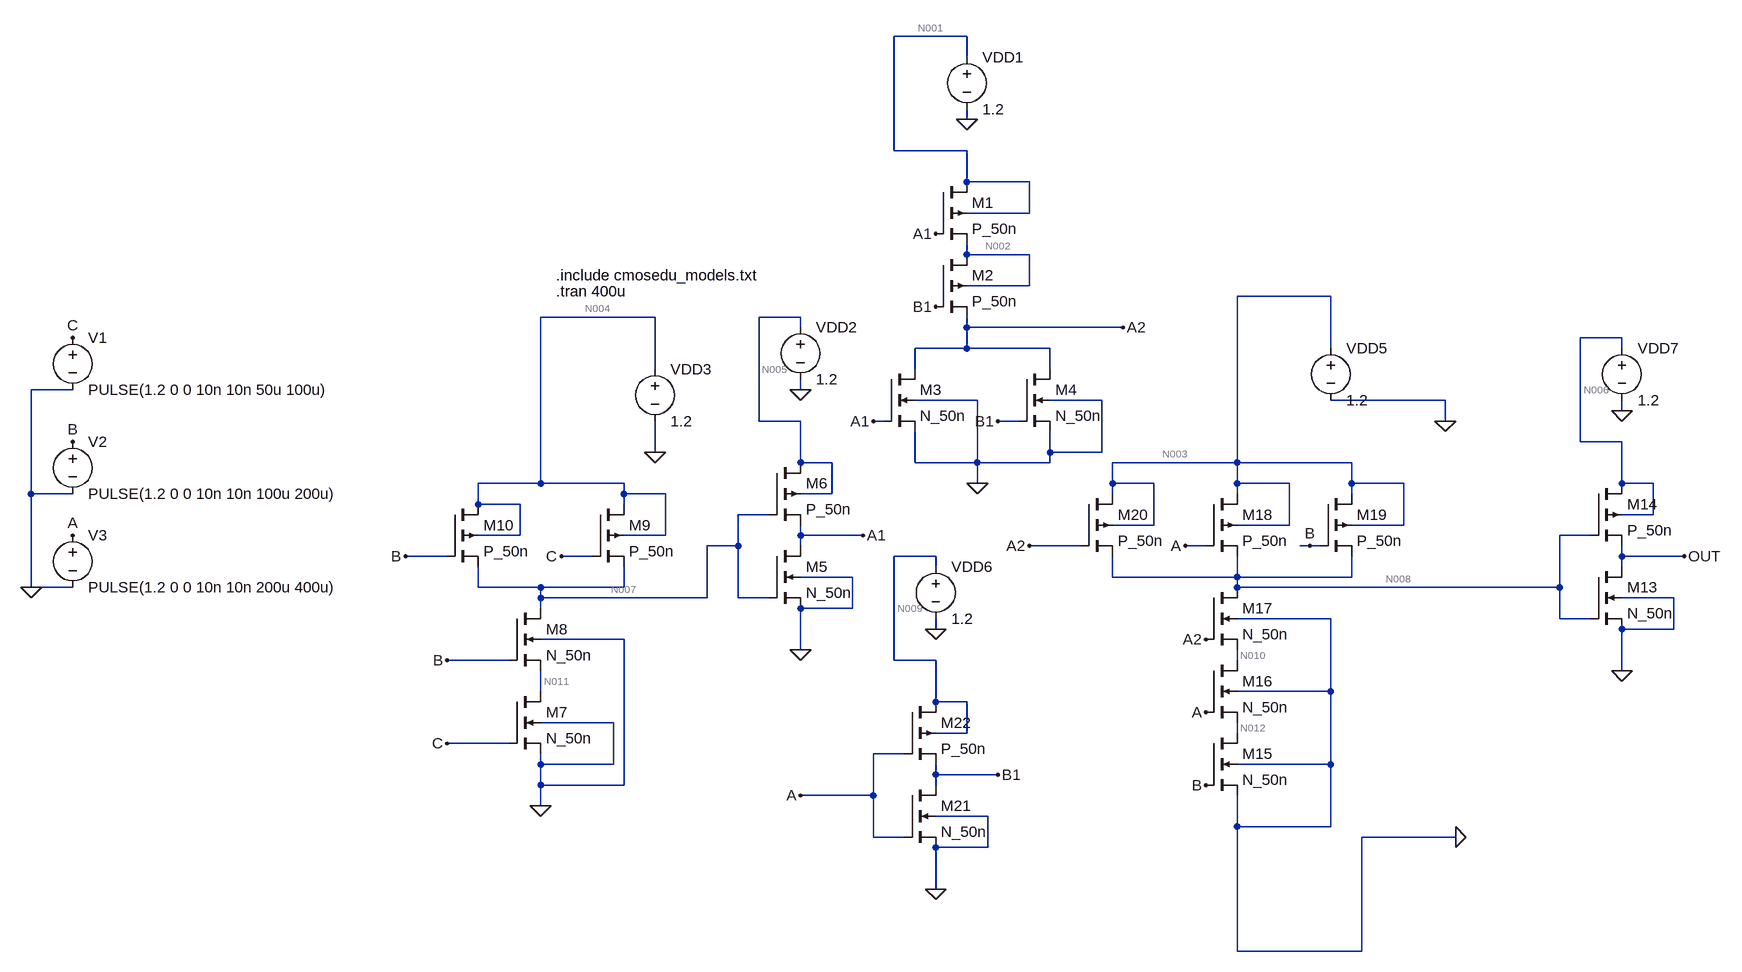
[diagram p0: schematic parte 4.asc]
parte 4.asc, the LTspice schematic file:
Version 4
SHEET 1 4500 1252
WIRE 1152 -736 1040 -736
WIRE 1152 -704 1152 -736
WIRE 1152 -608 1152 -624
WIRE 1040 -560 1040 -736
WIRE 1152 -560 1040 -560
WIRE 1152 -512 1152 -560
WIRE 1248 -512 1152 -512
WIRE 1248 -464 1248 -512
WIRE 1248 -464 1152 -464
WIRE 1152 -400 1152 -416
WIRE 1248 -400 1152 -400
WIRE 1248 -352 1248 -400
WIRE 1248 -352 1152 -352
WIRE 1712 -336 1568 -336
WIRE 672 -304 496 -304
WIRE 896 -304 832 -304
WIRE 896 -288 896 -304
WIRE 1152 -288 1152 -304
WIRE 1392 -288 1152 -288
WIRE 2160 -272 2096 -272
WIRE 1152 -256 1152 -288
WIRE 1152 -256 1072 -256
WIRE 1280 -256 1152 -256
WIRE 1712 -256 1712 -336
WIRE 2160 -256 2160 -272
WIRE 672 -224 672 -304
WIRE 1072 -224 1072 -256
WIRE 1280 -224 1280 -256
WIRE -224 -192 -288 -192
WIRE 896 -192 896 -208
WIRE 1168 -176 1072 -176
WIRE 1360 -176 1280 -176
WIRE 1888 -176 1712 -176
WIRE 2160 -160 2160 -176
WIRE 832 -144 832 -304
WIRE 896 -144 832 -144
WIRE 1024 -144 1008 -144
WIRE 1232 -144 1200 -144
WIRE 1888 -144 1888 -176
WIRE 2096 -112 2096 -272
WIRE 2160 -112 2096 -112
WIRE 672 -96 672 -144
WIRE 1280 -96 1280 -128
WIRE 1360 -96 1360 -176
WIRE 1360 -96 1280 -96
WIRE 896 -80 896 -144
WIRE 944 -80 896 -80
WIRE 1072 -80 1072 -128
WIRE 1168 -80 1168 -176
WIRE 1168 -80 1072 -80
WIRE 1280 -80 1280 -96
WIRE 1280 -80 1168 -80
WIRE 1568 -80 1568 -336
WIRE 1568 -80 1376 -80
WIRE 1744 -80 1568 -80
WIRE 496 -48 496 -304
WIRE 496 -48 400 -48
WIRE 624 -48 496 -48
WIRE 1168 -48 1168 -80
WIRE 1376 -48 1376 -80
WIRE 1440 -48 1376 -48
WIRE 1568 -48 1568 -80
WIRE 1648 -48 1568 -48
WIRE 1744 -48 1744 -80
WIRE 1824 -48 1744 -48
WIRE 2160 -48 2160 -112
WIRE 2208 -48 2160 -48
WIRE -288 -32 -288 -192
WIRE -224 -32 -288 -32
WIRE 624 -32 624 -48
WIRE 688 -32 624 -32
WIRE 944 -32 944 -80
WIRE 944 -32 896 -32
WIRE 1376 -32 1376 -48
WIRE 1568 -32 1568 -48
WIRE 1744 -32 1744 -48
WIRE 400 -16 400 -48
WIRE 464 -16 400 -16
WIRE 624 -16 624 -32
WIRE 848 0 800 0
WIRE 2208 0 2208 -48
WIRE 2208 0 2160 0
WIRE 1440 16 1440 -48
WIRE 1440 16 1376 16
WIRE 1648 16 1648 -48
WIRE 1648 16 1568 16
WIRE 1824 16 1824 -48
WIRE 1824 16 1744 16
WIRE 464 32 464 -16
WIRE 464 32 400 32
WIRE 688 32 688 -32
WIRE 688 32 624 32
WIRE 896 32 896 16
WIRE 992 32 896 32
WIRE 2112 32 2064 32
WIRE 800 48 800 0
WIRE 800 48 752 48
WIRE 896 48 896 32
WIRE 1328 48 1248 48
WIRE 1520 48 1488 48
WIRE 1680 48 1664 48
WIRE 1696 48 1680 48
WIRE 352 64 288 64
WIRE 576 64 528 64
WIRE 1104 64 1040 64
WIRE 2160 64 2160 48
WIRE 2256 64 2160 64
WIRE 1104 80 1104 64
WIRE 2160 80 2160 64
WIRE 976 96 896 96
WIRE 1376 96 1376 64
WIRE 1568 96 1568 64
WIRE 1568 96 1376 96
WIRE 1744 96 1744 64
WIRE 1744 96 1568 96
WIRE -288 112 -288 -32
WIRE -224 112 -288 112
WIRE 400 112 400 80
WIRE 496 112 400 112
WIRE 624 112 624 80
WIRE 624 112 496 112
WIRE 1568 112 1568 96
WIRE 2064 112 2064 32
WIRE 2064 112 1568 112
WIRE 496 128 496 112
WIRE 752 128 752 48
WIRE 752 128 496 128
WIRE 800 128 800 48
WIRE 848 128 800 128
WIRE 2240 128 2160 128
WIRE 496 144 496 128
WIRE 976 144 976 96
WIRE 976 144 896 144
WIRE 1712 160 1568 160
WIRE 2064 160 2064 112
WIRE 2112 160 2064 160
WIRE 1104 176 1104 160
WIRE 2240 176 2240 128
WIRE 2240 176 2160 176
WIRE 624 192 496 192
WIRE 896 208 896 144
WIRE 448 224 352 224
WIRE 1040 224 1040 64
WIRE 1104 224 1040 224
WIRE 1568 224 1568 208
WIRE 2160 240 2160 176
WIRE 496 272 496 240
WIRE 1712 272 1712 160
WIRE 1712 272 1568 272
WIRE 1104 288 1104 224
WIRE 1152 288 1104 288
WIRE 608 320 496 320
WIRE 1152 336 1152 288
WIRE 1152 336 1104 336
WIRE 1568 336 1568 320
WIRE 448 352 352 352
WIRE 1056 368 1008 368
WIRE 496 384 496 368
WIRE 608 384 608 320
WIRE 608 384 496 384
WIRE 1712 384 1712 272
WIRE 1712 384 1568 384
WIRE 1104 400 1104 384
WIRE 1200 400 1104 400
WIRE 496 416 496 384
WIRE 624 416 624 192
WIRE 624 416 496 416
WIRE 1104 416 1104 400
WIRE 1008 432 1008 368
WIRE 1008 432 896 432
WIRE 496 448 496 416
WIRE 1184 464 1104 464
WIRE 1568 480 1568 432
WIRE 1712 480 1712 384
WIRE 1712 480 1568 480
WIRE 1008 496 1008 432
WIRE 1056 496 1008 496
WIRE 1904 496 1760 496
WIRE 1184 512 1184 464
WIRE 1184 512 1104 512
WIRE 1104 576 1104 512
WIRE 1568 672 1568 480
WIRE 1760 672 1760 496
WIRE 1760 672 1568 672
FLAG 1152 -608 0
FLAG 1168 -48 0
FLAG 896 208 0
FLAG 896 -192 0
FLAG 992 32 A1
FLAG 672 -96 0
FLAG 496 448 0
FLAG 1680 48 B
FLAG 1888 -144 0
FLAG 1904 496 0
FLAG 1104 576 0
FLAG 1104 176 0
FLAG 288 64 B
FLAG 352 224 B
FLAG 352 352 C
FLAG 528 64 C
FLAG -288 112 0
FLAG -224 -272 C
FLAG -224 -112 B
FLAG -224 32 A
FLAG 896 432 A
FLAG 1008 -144 A1
FLAG 1104 -432 A1
FLAG 1200 400 B1
FLAG 1104 -320 B1
FLAG 1200 -144 B1
FLAG 1392 -288 A2
FLAG 1248 48 A2
FLAG 1520 192 A2
FLAG 1488 48 A
FLAG 1520 304 A
FLAG 1520 416 B
FLAG 2160 240 0
FLAG 2160 -160 0
FLAG 2256 64 OUT
SYMBOL pmos4 1104 -512 R0
SYMATTR InstName M1
SYMATTR Value P_50n
SYMATTR Value2 l=50n w=1.12u
SYMBOL pmos4 1104 -400 R0
SYMATTR InstName M2
SYMATTR Value P_50n
SYMATTR Value2 l=50n w=1.12u
SYMBOL nmos4 1024 -224 R0
SYMATTR InstName M3
SYMATTR Value N_50n
SYMATTR Value2 l=50n w=0.5u
SYMBOL nmos4 1232 -224 R0
SYMATTR InstName M4
SYMATTR Value N_50n
SYMATTR Value2 l=50n w=0.5u
SYMBOL voltage 1152 -720 R0
WINDOW 123 0 0 Left 2
WINDOW 39 0 0 Left 2
SYMATTR InstName VDD1
SYMATTR Value 1.2
SYMBOL nmos4 848 48 R0
SYMATTR InstName M5
SYMATTR Value N_50n
SYMATTR Value2 l=50n w=0.5u
SYMBOL pmos4 848 -80 R0
SYMATTR InstName M6
SYMATTR Value P_50n
SYMATTR Value2 l=50n w=0.5u
SYMBOL voltage 896 -304 R0
WINDOW 123 0 0 Left 2
WINDOW 39 0 0 Left 2
SYMATTR InstName VDD2
SYMATTR Value 1.2
SYMBOL nmos4 448 272 R0
SYMATTR InstName M7
SYMATTR Value N_50n
SYMATTR Value2 l=50n w=0.5u
SYMBOL nmos4 448 144 R0
SYMATTR InstName M8
SYMATTR Value N_50n
SYMATTR Value2 l=50n w=0.5u
SYMBOL pmos4 576 -16 R0
SYMATTR InstName M9
SYMATTR Value P_50n
SYMATTR Value2 l=50n w=1.12u
SYMBOL pmos4 352 -16 R0
SYMATTR InstName M10
SYMATTR Value P_50n
SYMATTR Value2 l=50n w=1.12u
SYMBOL voltage 672 -240 R0
WINDOW 123 0 0 Left 2
WINDOW 39 0 0 Left 2
SYMATTR InstName VDD3
SYMATTR Value 1.2
SYMBOL nmos4 1520 336 R0
SYMATTR InstName M15
SYMATTR Value N_50n
SYMATTR Value2 l=50n w=0.5u
SYMBOL nmos4 1520 224 R0
SYMATTR InstName M16
SYMATTR Value N_50n
SYMATTR Value2 l=50n w=0.5u
SYMBOL nmos4 1520 112 R0
SYMATTR InstName M17
SYMATTR Value N_50n
SYMATTR Value2 l=50n w=0.5u
SYMBOL pmos4 1520 -32 R0
SYMATTR InstName M18
SYMATTR Value P_50n
SYMATTR Value2 l=50n w=1.12u
SYMBOL pmos4 1696 -32 R0
SYMATTR InstName M19
SYMATTR Value P_50n
SYMATTR Value2 l=50n w=1.12u
SYMBOL pmos4 1328 -32 R0
SYMATTR InstName M20
SYMATTR Value P_50n
SYMATTR Value2 l=50n w=1.12u
SYMBOL voltage 1712 -272 R0
WINDOW 123 0 0 Left 2
WINDOW 39 0 0 Left 2
SYMATTR InstName VDD5
SYMATTR Value 1.2
SYMBOL nmos4 1056 416 R0
SYMATTR InstName M21
SYMATTR Value N_50n
SYMATTR Value2 l=50n w=0.5u
SYMBOL pmos4 1056 288 R0
SYMATTR InstName M22
SYMATTR Value P_50n
SYMATTR Value2 l=50n w=0.5u
SYMBOL voltage 1104 64 R0
WINDOW 123 0 0 Left 2
WINDOW 39 0 0 Left 2
SYMATTR InstName VDD6
SYMATTR Value 1.2
SYMBOL voltage -224 -288 R0
SYMATTR InstName V1
SYMATTR Value PULSE(1.2 0 0 10n 10n 50u 100u)
SYMBOL voltage -224 -128 R0
SYMATTR InstName V2
SYMATTR Value PULSE(1.2 0 0 10n 10n 100u 200u)
SYMBOL voltage -224 16 R0
SYMATTR InstName V3
SYMATTR Value PULSE(1.2 0 0 10n 10n 200u 400u)
SYMBOL nmos4 2112 80 R0
SYMATTR InstName M13
SYMATTR Value N_50n
SYMATTR Value2 l=50n w=0.5u
SYMBOL pmos4 2112 -48 R0
SYMATTR InstName M14
SYMATTR Value P_50n
SYMATTR Value2 l=50n w=0.5u
SYMBOL voltage 2160 -272 R0
WINDOW 123 0 0 Left 2
WINDOW 39 0 0 Left 2
SYMATTR InstName VDD7
SYMATTR Value 1.2
TEXT 520 -368 Left 2 !.include cmosedu_models.txt
TEXT 520 -344 Left 2 !.tran 400u

The netlist it stands for:
* parte 4.asc
M1 N001 A1 N002 N001 P_50n l=50n w=1.12u
M2 N002 B1 A2 N002 P_50n l=50n w=1.12u
M3 A2 A1 0 0 N_50n l=50n w=0.5u
M4 A2 B1 0 0 N_50n l=50n w=0.5u
VDD1 N001 0 1.2
M5 A1 N007 0 0 N_50n l=50n w=0.5u
M6 N005 N007 A1 N005 P_50n l=50n w=0.5u
VDD2 N005 0 1.2
M7 N011 C 0 0 N_50n l=50n w=0.5u
M8 N007 B N011 0 N_50n l=50n w=0.5u
M9 N004 C N007 N004 P_50n l=50n w=1.12u
M10 N004 B N007 N004 P_50n l=50n w=1.12u
VDD3 N004 0 1.2
M15 N012 B 0 0 N_50n l=50n w=0.5u
M16 N010 A N012 0 N_50n l=50n w=0.5u
M17 N008 A2 N010 0 N_50n l=50n w=0.5u
M18 N003 A N008 N003 P_50n l=50n w=1.12u
M19 N003 B N008 N003 P_50n l=50n w=1.12u
M20 N003 A2 N008 N003 P_50n l=50n w=1.12u
VDD5 N003 0 1.2
M21 B1 A 0 0 N_50n l=50n w=0.5u
M22 N009 A B1 N009 P_50n l=50n w=0.5u
VDD6 N009 0 1.2
V1 C 0 PULSE(1.2 0 0 10n 10n 50u 100u)
V2 B 0 PULSE(1.2 0 0 10n 10n 100u 200u)
V3 A 0 PULSE(1.2 0 0 10n 10n 200u 400u)
M13 OUT N008 0 0 N_50n l=50n w=0.5u
M14 N006 N008 OUT N006 P_50n l=50n w=0.5u
VDD7 N006 0 1.2
.model NMOS NMOS
.model PMOS PMOS
.lib standard.mos
.include cmosedu_models.txt
.tran 400u
.backanno
.end

* Results of the author's LTspice run, read from the files saved beside the schematic
* Operating Point, zero values left out:
*   V(n001) = 1.2 V
*   V(a1) = 1.2 V
*   V(n002) = 106.9 mV
*   V(b1) = 18.73 µV
*   V(a2) = 76.24 µV
*   V(n007) = 201.5 µV
*   V(n005) = 1.2 V
*   V(n011) = 103 µV
*   V(c) = 1.2 V
*   V(b) = 1.2 V
*   V(n004) = 1.2 V
*   V(n012) = 10.28 µV
*   V(n010) = 16.08 µV
*   V(a) = 1.2 V
*   V(n008) = 1.2 V
*   V(n003) = 1.2 V
*   V(n009) = 1.2 V
*   V(out) = 18.72 µV
*   V(n006) = 1.2 V
*   Id(M13) = 16.29 nA
*   Ig(M13) = 5.148 nA
*   Ib(M13) = -713.8 pA
*   Is(M13) = -20.73 nA
*   Id(M21) = 16.3 nA
*   Ig(M21) = 5.149 nA
*   Ib(M21) = -714.3 pA
*   Is(M21) = -20.74 nA
*   Id(M17) = 5.104 nA
*   Ig(M17) = -1.586 nA
*   Ib(M17) = -3.775 pA
*   Is(M17) = -3.514 nA
*   Id(M16) = 3.514 nA
*   Ig(M16) = 5.149 nA
*   Ib(M16) = -714.2 pA
*   Is(M16) = -7.949 nA
*   Id(M15) = 7.949 nA
*   Ig(M15) = 5.149 nA
*   Ib(M15) = -714.3 pA
*   Is(M15) = -12.38 nA
*   Id(M8) = 95.2 nA
*   Ig(M8) = 5.146 nA
*   Ib(M8) = -713.5 pA
*   Is(M8) = -99.63 nA
*   Id(M7) = 99.63 nA
*   Ig(M7) = 5.149 nA
*   Ib(M7) = -714.3 pA
*   Is(M7) = -104.1 nA
*   Id(M5) = 5.118 nA
*   Ig(M5) = -1.585 nA
*   Ib(M5) = -3.75 pA
*   Is(M5) = -3.529 nA
*   Id(M4) = 2.816 pA
*   Is(M4) = -2.816 pA
*   Id(M3) = 73.16 nA
*   Ig(M3) = 5.146 nA
*   Ib(M3) = -713.4 pA
*   Is(M3) = -77.59 nA
*   Id(M14) = 4.638 nA
*   Ig(M14) = 11.65 nA
*   Ib(M14) = 3.793 pA
*   Is(M14) = -16.29 nA
*   Id(M22) = 4.632 nA
*   Ig(M22) = 11.65 nA
*   Ib(M22) = 3.8 pA
*   Is(M22) = -16.29 nA
*   Id(M20) = 63.76 nA
*   Ig(M20) = -44.99 nA
*   Ib(M20) = 3.132 nA
*   Is(M20) = -21.9 nA
*   Id(M19) = 2.295 pA
*   Is(M19) = -2.299 pA
*   Id(M18) = 2.295 pA
*   Is(M18) = -2.299 pA
*   Id(M10) = 10.49 nA
*   Ig(M10) = 26.38 nA
*   Ib(M10) = 6.966 pA
*   Is(M10) = -36.88 nA
*   Id(M9) = 10.49 nA
*   Ig(M9) = 26.38 nA
*   Ib(M9) = 6.966 pA
*   Is(M9) = -36.88 nA
*   Id(M6) = 46.57 nA
*   Ig(M6) = -19.85 nA
*   Ib(M6) = 1.38 nA
*   Is(M6) = -28.1 nA
*   Id(M2) = 26.6 nA
*   Ig(M2) = -12.62 pA
*   Is(M2) = -26.59 nA
*   Id(M1) = 8.765 nA
*   Ig(M1) = 17.83 nA
*   Ib(M1) = 1.104 pA
*   Is(M1) = -26.6 nA
*   I(Vdd7) = -4.642 nA
*   I(V3) = -21.95 nA
*   I(V2) = -36.68 nA
*   I(V1) = -31.53 nA
*   I(Vdd6) = -4.636 nA
*   I(Vdd5) = -66.89 nA
*   I(Vdd3) = -21 nA
*   I(Vdd2) = -47.95 nA
*   I(Vdd1) = -8.766 nA
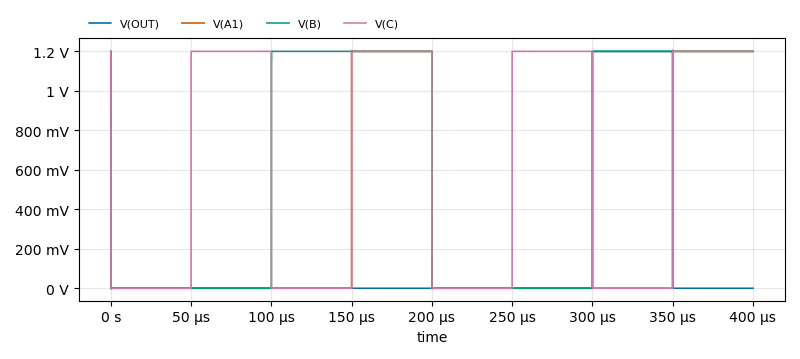
[diagram p1: Transient Analysis of parte 4.asc, plotted from the saved traces]
* Transient Analysis, 1 run:
*   V(OUT): min -2.999 mV, max 1.205 V, average 150 mV, rms 424.3 mV, last 18.61 µV
*   V(A1): min -2.701 mV, max 1.203 V, average 300 mV, rms 599.9 mV, last 1.2 V
*   V(B): min 0 V, max 1.2 V, average 599.9 mV, rms 848.5 mV, last 1.2 V
*   V(C): min 0 V, max 1.2 V, average 599.9 mV, rms 848.4 mV, last 1.2 V